# Altium project ad_via.PrjPcb
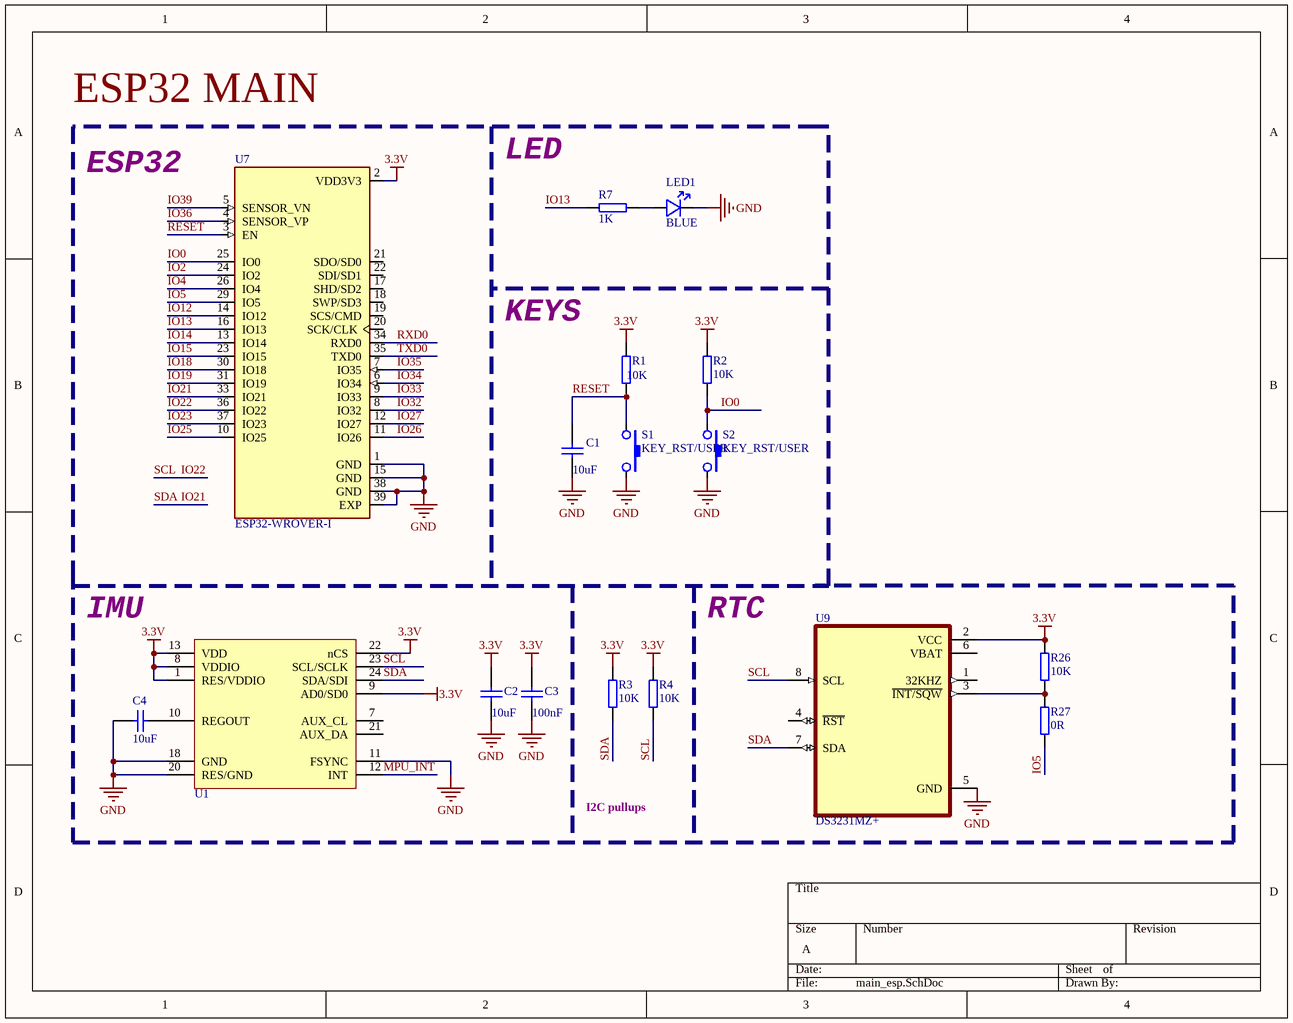
[diagram p0: main_esp.SchDoc]
4 sheets, 61 parts. Net scope: global (net labels, ports and power ports of the same name join across sheets).
Board file: VIA2.PcbDoc
Sheets:
  main_esp.SchDoc
  POWER.SchDoc
  CONNECTROS.SchDoc
  RS485_CAN.SchDoc

## Sheet main_esp.SchDoc
size A

### Parts
C1  value 10uF  [SMT0603]  (hidden comment: Cap Semi)
C2  value 10uF  [SMT0603]  (hidden comment: Cap Semi)
C3  value 100nF  [SMT0603]  (hidden comment: Cap Semi)
C4  value 10uF  [SMT0603]  (hidden comment: Cap Semi)
LED1  BLUE  [SMT0603P]
R1  value 10K  [SMT0603]  (hidden comment: Resistor)
R2  value 10K  [SMT0603]  (hidden comment: Resistor)
R3  value 10K  [SMT0603]  (hidden comment: Resistor)
R4  value 10K  [SMT0603]  (hidden comment: Resistor)
R7  value 1K  [SMT0603]  (hidden comment: Resistor)
R26  value 10K  [SMT0603]  (hidden comment: Resistor)
R27  value 0R  [SMT0603]  (hidden comment: Resistor)
S1  KEY_RST/USER  [SMT_SW_PTS_820]
S2  KEY_RST/USER  [SMT_SW_PTS_820]
U1  MPU-9250  (value not drawn)
U7  ESP32-WROVER-I  [XCVR_ESP32-WROVER-I]
U9  DS3231MZ+  [SOIC127P600X175-8N]

### Blocks framed on the sheet
ESP32 MAIN: C1 LED1 R1 R2 R7 S1 S2 U7

### Nets
3.3V: C2.2 C3.2 R1.2 R2.2 R3.2 R4.2 R26.1 U1.1(RES/VDDIO) U1.8(VDDIO) U1.9(AD0/SD0) U1.13(VDD) U1.22(nCS) U7.2(VDD3V3) U9.2(VCC)
GND: C1.1 C2.1 C3.1 C4.2 LED1.2 S1.2 S2.2 U1.11(FSYNC) U1.18(GND) U1.20(RES/GND) U7.1(GND) U7.15(GND) U7.38(GND) U7.39(EXP) U9.5(GND)
IO0: R2.1 S2.1 U7.25(IO0)
IO2: U7.24(IO2)
IO4: U7.26(IO4)
IO5: R27.2 U7.29(IO5)
IO12: U7.14(IO12)
IO13: R7.1 U7.16(IO13)
IO14: U7.13(IO14)
IO15: U7.23(IO15)
IO18: U7.30(IO18)
IO19: U7.31(IO19)
IO21: R3.1 U1.24(SDA/SDI) U7.33(IO21) U9.7(SDA)  [also labelled SDA]
IO22: R4.1 U1.23(SCL/SCLK) U7.36(IO22) U9.8(SCL)  [also labelled SCL]
IO23: U7.37(IO23)  [project net CAN_RX]
IO25: U7.10(IO25)  [project net CAN_TX]
IO26: U7.11(IO26)
IO27: U7.12(IO27)
IO32: U7.8(IO32)  [project net DI]
IO33: U7.9(IO33)
IO34: U7.6(IO34)
IO35: U7.7(IO35)
IO36: U7.4(SENSOR_VP)
IO39: U7.5(SENSOR_VN)
MPU_INT: U1.12(INT)
RESET: C1.2 R1.1 S1.1 U7.3(EN)
RXD0: U7.34(RXD0)
TXD0: U7.35(TXD0)
NetC4_1: C4.1 U1.10(REGOUT)
NetLED1_1: LED1.1 R7.2
NetR26_2: R26.2 R27.1 U9.3(~{INT/SQW})

Not connected (* = marked no-connect by the designer): U1 7(AUX_CL) 21(AUX_DA); U7 17(SHD/SD2) 18(SWP/SD3) 19(SCS/CMD) 20(SCK/CLK) 21(SDO/SD0) 22(SDI/SD1); U9 1(32KHZ) 4(~{RST}) 6(VBAT)

### Notes on the sheet
- LED
- ESP32
- KEYS
- IMU
- RTC
- I2C pullups

### Library data of the parts
C1 C2 C4 = CAP-SM-0603-X5R-10uF: CAP SM 0603 X5R 10uF 10%; Tolerance: ±10%; Supplier 1: Farnell; Supplier 2: Digi-Key; Supplier Part Number 1: 2366833; Supplier Part Number 2: 490-3896-1-ND
C3 = CAP-SM-0603-X7R-100nF: CAP SM 0603 X7R 100nF 10%; Tolerance: ±10%; Supplier 1: Digi-Key; Supplier 2: Farnell; Supplier Part Number 1: 490-3167-1-ND; Supplier Part Number 2: 1775994RL
LED1 = LNJ937W8CRA: LED SM 0603 BLUE 2V9 FWD VOLTAGE; Forward Voltage: 2.9V; Supplier 1: Digi-Key; Supplier Part Number 1: LNJ937W8CRACT-ND
R1-R4 R26 R27 = RES-SM-0603-10K: RES SM 0603 10K; Supplier 1: Farnell; Supplier 2: Digi-Key; Supplier Part Number 1: 9330399; Supplier Part Number 2: 541-10.0KHCT-ND
R7 = RES-SM-0603-1K: RES SM 0603 1K
S1 S2 = SMT_SW_PTS_820: SMT Tactile ‎Switch PTS 820 Series
U7 = ESP32-WROVER-I: Bluetooth, WiFi 802.11b/g/n, Bluetooth v4.2 + EDR, Class 1, 2 and 3 Transceiver Module 2.4GHz ~ 2.5GHz Antenna Not Included, I-PEX Surface Mount; MF: Espressif Systems; Package: Module Espressif Systems; Availability: Unavailable; MP: ESP32-WROVER-I; Value: *; SnapEDA_Link: https://www.snapeda.com/parts/ESP32-WROVER-I/Espressif%20Systems/view-part/2298808/?ref=snap; Price: None
U9 = DS3231MZ+: Real Time Clock _RTC_ IC Clock/Calendar IÂ²C, 2-Wire Serial 8-SOIC _0.154, 3.90mm Width_; MF: Maxim Integrated; MP: DS3231MZ; Price: None; Availability: Unavailable; Package: SOIC-8 Maxim Integrated; SnapEDA_Link: https://www.snapeda.com/parts/DS3231MZ/Maxim%20Integrated/view-part/2834343/?ref=snap; Value: *

## Sheet POWER.SchDoc
size A
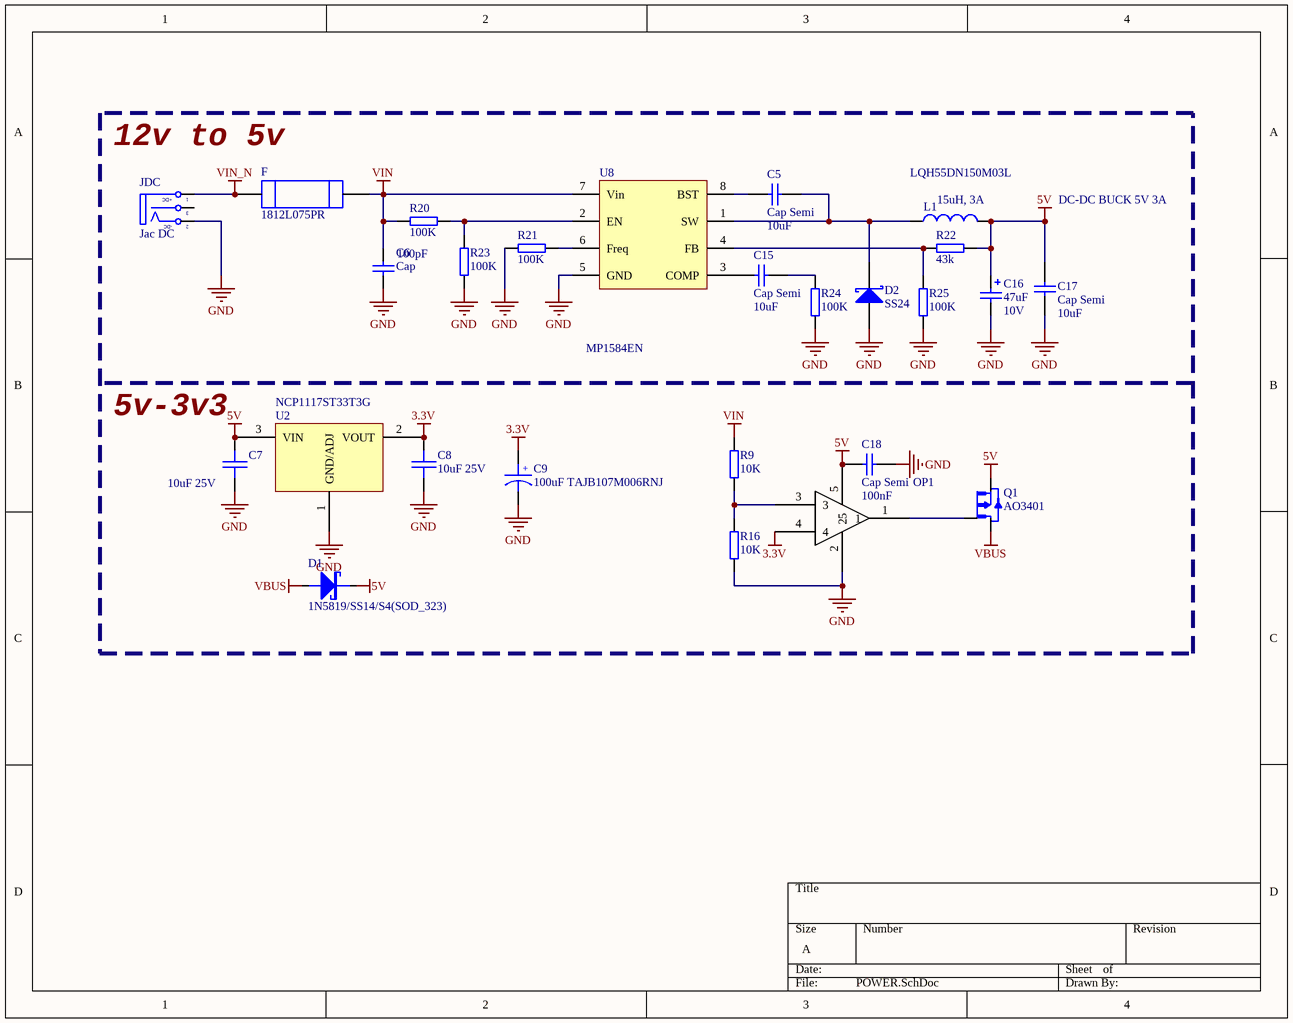
[diagram p1: POWER.SchDoc]

### Parts
C5  Cap Semi  value 10uF  [SMT0603]
C6  Cap  value 100pF  [CN-SMD-1206]
C7  10uF 25V  [SMT_C_0805]
C8  10uF 25V  [SMT_C_0805]
C9  100uF TAJB107M006RNJ  [SMT_C_Tantalum_B]
C15  Cap Semi  value 10uF  [SMT0603]
C16  47uF  Voltage: 10V  [Tantal_B]
C17  Cap Semi  value 10uF  [SMT0603]
C18  Cap Semi  value 100nF  [SMT0603]
D1  1N5819/SS14/S4(SOD_323)  [SMT_DIODE_SOD_323]
D2  SS24  [SMB]
F  1812L075PR  [1812]
JDC  Jac DC  [DC-IN]
L1  15uH, 3A  Marka: LQH55DN150M03L  [Inductor SMD 6.8*6.8*4.5]
OP1  Component_1  [SOT23-5]  (value not drawn)
Q1  AO3401  [SOT23]
R9  value 10K  [SMT0603]  (hidden comment: Resistor)
R16  value 10K  [SMT0603]  (hidden comment: Resistor)
R20  value 100K  [SMT0603]  (hidden comment: Resistor)
R21  value 100K  [SMT0603]  (hidden comment: Resistor)
R22  value 43k  [SMT0603]  (hidden comment: Resistor)
R23  value 100K  [SMT0603]  (hidden comment: Resistor)
R24  value 100K  [SMT0603]  (hidden comment: Resistor)
R25  value 100K  [SMT0603]  (hidden comment: Resistor)
U2  NCP1117ST33T3G  [SOT-223]
U8  MP1584EN  [SOIC127P600X170-9N]

### Nets
3.3V: C8.1 C9.1 OP1.4 U2.2(VOUT)
5V: C7.1 C16.1 C17.1 C18.1 D1.2(K) L1.2 OP1.5 Q1.2(S) R22.1 U2.3(VIN)
GND: C6.2 C7.2 C8.2 C9.2 C16.2 C17.2 C18.2 D2.1(A) JDC.2(TN) OP1.2 R16.1 R21.1 R23.2 R24.1 R25.2 U2.1(GND/ADJ) U8.5(GND)
VBUS: D1.1(A) Q1.3(D)
VIN: C6.1 F.2 R9.2 R20.1 U8.7(Vin)
VIN_N: F.1 JDC.1(T)
NetC5_1: C5.1 D2.2(K) L1.1 U8.1(SW)
NetC5_2: C5.2 U8.8(BST)
NetC15_1: C15.1 R24.2
NetC15_2: C15.2 U8.3(COMP)
NetOP1_1: OP1.1 Q1.1(G)
NetOP1_3: OP1.3 R9.1 R16.2
NetR20_2: R20.2 R23.1 U8.2(EN)
NetR21_2: R21.2 U8.6(Freq)
NetR22_2: R22.2 R25.1 U8.4(FB)

Not connected (* = marked no-connect by the designer): JDC 3(S)

### Notes on the sheet
- 12v to 5v
- DC-DC BUCK 5V 3A
- (near C7) 5v-3v3
- (in symbol DCIN) +DC; -DC
- (in symbol SMT_C_Tantalum_B) +

### Library data of the parts
C5 C15 C17 = CAP-SM-0603-X5R-10uF: CAP SM 0603 X5R 10uF 10%; Tolerance: ±10%; Supplier 1: Farnell; Supplier 2: Digi-Key; Supplier Part Number 1: 2366833; Supplier Part Number 2: 490-3896-1-ND
C6 = Cap: Capacitor; Published: 8-Jun-2000; LatestRevisionDate: 17-Jul-2002; LatestRevisionNote: Re-released for DXP Platform.; PackageReference: RAD-0.3; Publisher: Altium Limited; PackageDescription: Radial Cap, Thru-Hole; 2 Leads; 0.3 in Pin Spacing
C7 C8 = SMT_C_0805: Surface mount capacitor 0805
C9 = SMT_C_Tantalum_B: Capacitor, SM Tantalum; Body 3.5 x 2.8 mm (LxW typ)
C16 = Cap Pol: Polarized Capacitor (Axial); Published: 8-Jun-2000; LatestRevisionDate: 17-Jul-2002; LatestRevisionNote: Re-released for DXP Platform.; PackageReference: POLAR0.8; Publisher: Altium Limited; PackageDescription: Polarized Capacitor; 2 Leads; links: https://www.promelec.ru/product/327656/; price: 12.53
C18 = CAP-SM-0603-X7R-100nF: CAP SM 0603 X7R 100nF 10%; Tolerance: ±10%; Supplier 1: Digi-Key; Supplier 2: Farnell; Supplier Part Number 1: 490-3167-1-ND; Supplier Part Number 2: 1775994RL
D1 = SMT_DIODE_SCHOTTKY_SOD_323: Surface mount schottky diode SOD-323(0805) Package
D2 = D Schottky: Schottky Diode; Published: 8-Jun-2000; LatestRevisionDate: 17-Jul-2002; LatestRevisionNote: Re-released for DXP Platform.; PackageReference: SMB; Publisher: Altium Limited; PackageDescription: DO-214-AA/SMB; 2 C-Bend Leads; Body 5.3 x 3.6 mm, inc. leads (LxW); Code_JEDEC: DO-214-AA
F = 1812L075PR: Polymeric PTC Resettable Fuse 13.2V 750mA Ih Surface Mount 1812 _4532 Metric_, Concave; MF: Littelfuse Inc.; SnapEDA_Link: https://www.snapeda.com/parts/1812L075PR/Littelfuse%20Inc./view-part/46903/?ref=snap; MP: 1812L075PR; Availability: Unavailable; Price: None; Value: *; Package: 1812 Littelfuse
JDC = DCIN: Jac DC input; Value: Jac DC
L1 = Inductor: price: 68.07; links: https://www.promelec.ru/product/318749/
Q1 = AO3401: P-Channel 30V 4A _Ta_ 1.4W _Ta_ Surface Mount SOT-23-3; MF: Alpha & Omega Semiconductor; Value: *; MP: AO3401; SnapEDA_Link: https://www.snapeda.com/parts/AO3401/Alpha%20%26%20Omega%20Semiconductor/view-part/4592622/?ref=snap; Availability: Unavailable; Package: SOT-23-3 Alpha &amp; Omega Semiconductor; Price: None
R9 R16 = RES-SM-0603-10K: RES SM 0603 10K; Supplier 1: Farnell; Supplier 2: Digi-Key; Supplier Part Number 1: 9330399; Supplier Part Number 2: 541-10.0KHCT-ND
R20-R25 = RES-SM-0603-100K: RES SM 0603 100K; Supplier 1: Farnell; Supplier 2: Digi-Key; Supplier Part Number 1: 1344361; Supplier Part Number 2: 541-100KHCT-ND
U2 = NCP1117: NCP1117, NCV1117. 1.0 A Low-Dropout Positive  Fixed and Adjustable  Voltage Regulators
U8 = MP1584: price: 53.54; links: https://www.promelec.ru/product/318330/

## Sheet CONNECTROS.SchDoc
size A
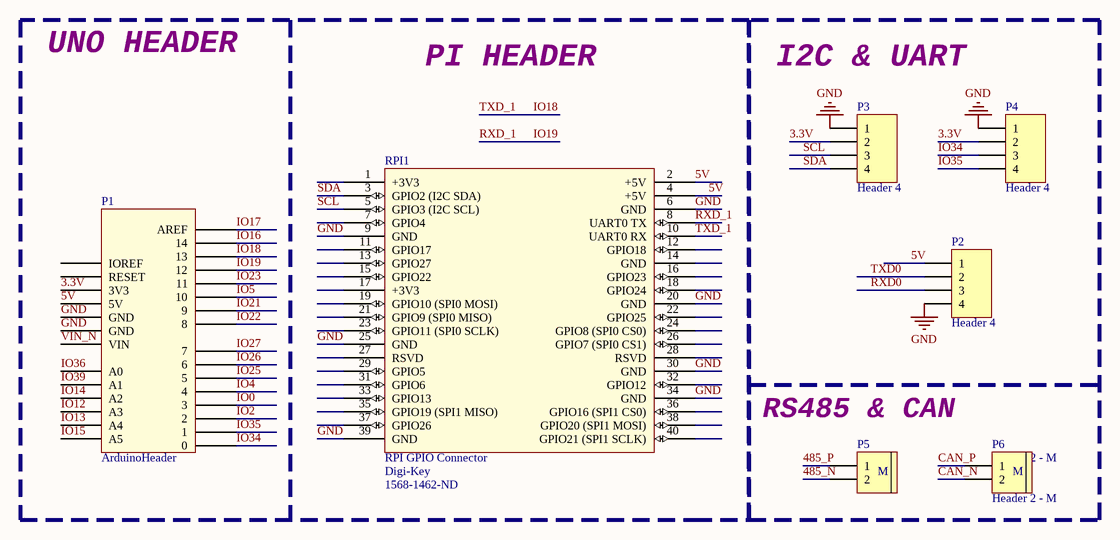
[diagram p2: CONNECTROS.SchDoc]

### Parts
P1  ArduinoHeader  [Arduino_header]
P2  Header 4  [HDR1X4]
P3  Header 4  [HDR1X4]
P4  Header 4  [HDR1X4]
P5  Header 2 - M  [Medium - Header 2]
P6  Header 2 - M  [Medium - Header 2]
RPI1  RPI GPIO Connector  Supplier 1: Digi-Key  Supplier Part Number 1: 1568-1462-ND  [rpi]

### Blocks framed on the sheet
I2C & UART: P2-P6

### Nets
3.3V: P1.3V3 P3.2 P4.2
5V: P1.5V P2.1 RPI1.2(+5V) RPI1.4(+5V)
GND: P1.GND P2.4 P3.1 P4.1 RPI1.6(GND) RPI1.9(GND) RPI1.20(GND) RPI1.25(GND) RPI1.30(GND) RPI1.34(GND) RPI1.39(GND)
VIN_N: P1.VIN
485_N: P5.2
485_P: P5.1
CAN_N: P6.2
CAN_P: P6.1
IO0: P1.3
IO2: P1.2
IO4: P1.4
IO5: P1.10
IO12: P1.A3
IO13: P1.A4
IO14: P1.A2
IO15: P1.A5
IO16: P1.14
IO17: P1.AREF
IO18: P1.13 RPI1.10(UART0_RX)  [also labelled TXD_1]
IO19: P1.12 RPI1.8(UART0_TX)  [also labelled RXD_1]
IO21: P1.9 P3.4 RPI1.3(GPIO2_(I2C_SDA))  [also labelled SDA]
IO22: P1.8 P3.3 RPI1.5(GPIO3_(I2C_SCL))  [also labelled SCL]
IO23: P1.11  [project net CAN_RX]
IO25: P1.5  [project net CAN_TX]
IO26: P1.6
IO27: P1.7
IO34: P1.0 P4.3
IO35: P1.1 P4.4
IO36: P1.A0
IO39: P1.A1
RXD0: P2.3
TXD0: P2.2

Not connected (* = marked no-connect by the designer): P1 IOREF RESET; RPI1 1(+3V3) 7(GPIO4) 11(GPIO17) 12(GPIO18) 13(GPIO27) 14(GND) 15(GPIO22) 16(GPIO23) 17(+3V3) 18(GPIO24) 19(GPIO10_(SPI0_MOSI)) 21(GPIO9_(SPI0_MISO)) 22(GPIO25) 23(GPIO11_(SPI0_SCLK)) 24(GPIO8_(SPI0_CS0)) 26(GPIO7_(SPI0_CS1)) 27(RSVD) 28(RSVD) 29(GPIO5) 31(GPIO6) 32(GPIO12) 33(GPIO13) 35(GPIO19_(SPI1_MISO)) 36(GPIO16_(SPI1_CS0)) 37(GPIO26) 38(GPIO20_(SPI1_MOSI)) 40(GPIO21_(SPI1_SCLK))

### Notes on the sheet
- UNO HEADER
- PI HEADER
- (near P5) RS485 & CAN
- (in symbol Header 2 - M) M

### Library data of the parts
P2-P4 = Header 4: Header, 4-Pin; LatestRevisionDate: 17-Jul-2002; LatestRevisionNote: Re-released for DXP Platform.; Publisher: Altium Limited
P5 P6 = Header 2 - M: Header, 2-Pin, Medium; LatestRevisionDate: 17-Jul-2002; LatestRevisionNote: Re-released for DXP Platform.; Publisher: Altium Limited
RPI1 = rpi connector: GPIO Header for Raspberry Pi A+/B+/Pi 2/Pi 3 - 2x20; Manufacturer: SparkFun Electronics; Manufacturer Part Number: PRT-14017; Nils Minor: author; nilsminor@web.de: mail; RoHS: RoHS Compliant; Category: Development Boards, Kits, Programmers; Stock 1: 150; Pricing 1: 1=1.84 (EUR); Part Status: Active; Accessory Type: Connector; For Use With/Related Products: Raspberry Pi; ComponentLink1URL: https://cdn.sparkfun.com/datasheets/Dev/RaspberryPi/12313.pdf; ComponentLink1Description: https://cdn.sparkfun.com/datasheets/Dev/RaspberryPi/12313.pdf

## Sheet RS485_CAN.SchDoc
size A
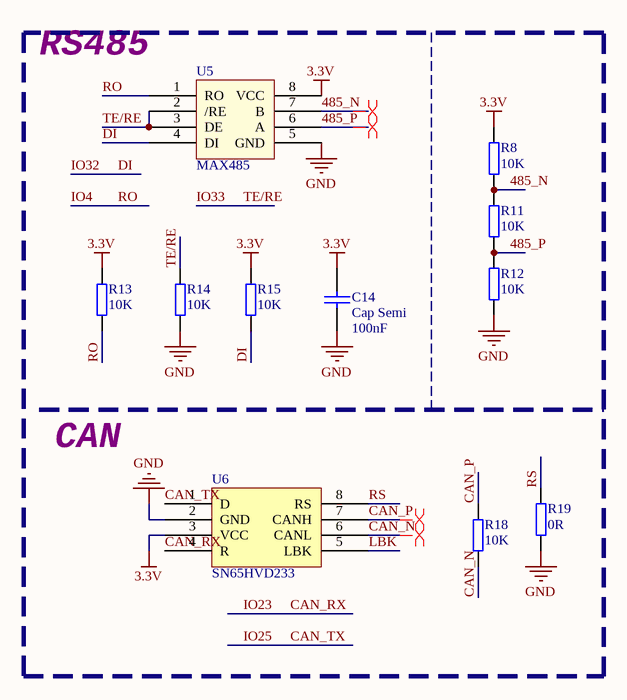
[diagram p3: RS485_CAN.SchDoc]

### Parts
C14  Cap Semi  value 100nF  [SMT0603]
R8  value 10K  [SMT0603]  (hidden comment: Resistor)
R11  value 10K  [SMT0603]  (hidden comment: Resistor)
R12  value 10K  [SMT0603]  (hidden comment: Resistor)
R13  value 10K  [SMT0603]  (hidden comment: Resistor)
R14  value 10K  [SMT0603]  (hidden comment: Resistor)
R15  value 10K  [SMT0603]  (hidden comment: Resistor)
R18  value 10K  [SMT0603]  (hidden comment: Resistor)
R19  value 0R  [SMT0603]  (hidden comment: Resistor)
U5  MAX485  [SOP8]
U6  SN65HVD233  [PCBComponent_1]

### Nets
3.3V: C14.2 R8.2 R13.2 R15.2 U5.8(VCC) U6.3(VCC)
GND: C14.1 R12.1 R14.1 R19.1 U5.5(GND) U6.2(GND)
485_N: R8.1 R11.2 U5.7(B)
485_P: R11.1 R12.2 U5.6(A)
CAN_N: R18.1 U6.6(CANL)
CAN_P: R18.2 U6.7(CANH)
CAN_RX: U6.4(R)  [also labelled IO23]
CAN_TX: U6.1(D)  [also labelled IO25]
DI: R15.1 U5.4(DI)  [also labelled IO32]
IO4: R13.1 U5.1(RO)  [also labelled RO]
IO33: R14.2 U5.2(/RE) U5.3(DE)  [also labelled TE/RE]
LBK: U6.5(LBK)
RS: R19.2 U6.8(RS)

### Layout directives
differential pair: 485_N, 485_P, CAN_N, CAN_P

### Notes on the sheet
- RS485
- CAN

### Library data of the parts
C14 = CAP-SM-0603-X7R-100nF: CAP SM 0603 X7R 100nF 10%; Tolerance: ±10%; Supplier 1: Digi-Key; Supplier 2: Farnell; Supplier Part Number 1: 490-3167-1-ND; Supplier Part Number 2: 1775994RL
R8 R11-R15 R18 R19 = RES-SM-0603-10K: RES SM 0603 10K; Supplier 1: Farnell; Supplier 2: Digi-Key; Supplier Part Number 1: 9330399; Supplier Part Number 2: 541-10.0KHCT-ND

## Nets that join several sheets
3.3V: main_esp (14 pins), POWER (C8.1 C9.1 OP1.4 U2.2), CONNECTROS (P1.3V3 P3.2 P4.2), RS485_CAN (6 pins)
5V: POWER (10 pins), CONNECTROS (P1.5V P2.1 RPI1.2 RPI1.4)
GND: main_esp (15 pins), POWER (17 pins), CONNECTROS (11 pins), RS485_CAN (6 pins)
VIN_N: POWER (F.1 JDC.1), CONNECTROS (P1.VIN)
485_N: CONNECTROS (P5.2), RS485_CAN (R8.1 R11.2 U5.7)
485_P: CONNECTROS (P5.1), RS485_CAN (R11.1 R12.2 U5.6)
CAN_N: CONNECTROS (P6.2), RS485_CAN (R18.1 U6.6)
CAN_P: CONNECTROS (P6.1), RS485_CAN (R18.2 U6.7)
CAN_RX: main_esp (U7.37), CONNECTROS (P1.11), RS485_CAN (U6.4)
CAN_TX: main_esp (U7.10), CONNECTROS (P1.5), RS485_CAN (U6.1)
DI: main_esp (U7.8), RS485_CAN (R15.1 U5.4)
IO0: main_esp (R2.1 S2.1 U7.25), CONNECTROS (P1.3)
IO2: main_esp (U7.24), CONNECTROS (P1.2)
IO4: main_esp (U7.26), CONNECTROS (P1.4), RS485_CAN (R13.1 U5.1)
IO5: main_esp (R27.2 U7.29), CONNECTROS (P1.10)
IO12: main_esp (U7.14), CONNECTROS (P1.A3)
IO13: main_esp (R7.1 U7.16), CONNECTROS (P1.A4)
IO14: main_esp (U7.13), CONNECTROS (P1.A2)
IO15: main_esp (U7.23), CONNECTROS (P1.A5)
IO18: main_esp (U7.30), CONNECTROS (P1.13 RPI1.10)
IO19: main_esp (U7.31), CONNECTROS (P1.12 RPI1.8)
IO21: main_esp (R3.1 U1.24 U7.33 U9.7), CONNECTROS (P1.9 P3.4 RPI1.3)
IO22: main_esp (R4.1 U1.23 U7.36 U9.8), CONNECTROS (P1.8 P3.3 RPI1.5)
IO26: main_esp (U7.11), CONNECTROS (P1.6)
IO27: main_esp (U7.12), CONNECTROS (P1.7)
IO33: main_esp (U7.9), RS485_CAN (R14.2 U5.2 U5.3)
IO34: main_esp (U7.6), CONNECTROS (P1.0 P4.3)
IO35: main_esp (U7.7), CONNECTROS (P1.1 P4.4)
IO36: main_esp (U7.4), CONNECTROS (P1.A0)
IO39: main_esp (U7.5), CONNECTROS (P1.A1)
RXD0: main_esp (U7.34), CONNECTROS (P2.3)
TXD0: main_esp (U7.35), CONNECTROS (P2.2)